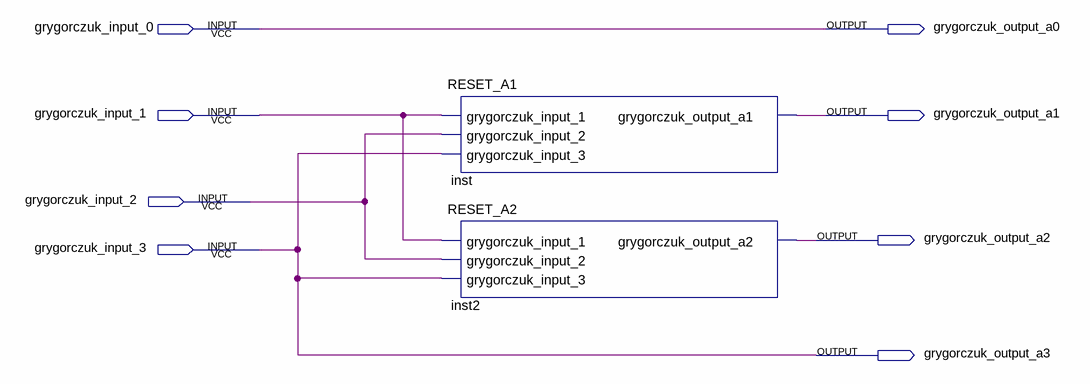
[diagram p0: schematic sheet]
// Quartus schematic RESET.bdf as structural Verilog: 2 symbols, 8 pins
module RESET (
  input  grygorczuk_input_0,
  input  grygorczuk_input_1,
  input  grygorczuk_input_2,
  input  grygorczuk_input_3,
  output grygorczuk_output_a0,
  output grygorczuk_output_a1,
  output grygorczuk_output_a2,
  output grygorczuk_output_a3
);

  RESET_A1 inst (
    .grygorczuk_input_1(grygorczuk_input_1), .grygorczuk_input_2(grygorczuk_input_2),
    .grygorczuk_input_3(grygorczuk_input_3), .grygorczuk_output_a1(grygorczuk_output_a1));
  RESET_A2 inst2 (
    .grygorczuk_input_1(grygorczuk_input_1), .grygorczuk_input_2(grygorczuk_input_2),
    .grygorczuk_input_3(grygorczuk_input_3), .grygorczuk_output_a2(grygorczuk_output_a2));

  assign grygorczuk_output_a0 = grygorczuk_input_0;
  assign grygorczuk_output_a3 = grygorczuk_input_3;
endmodule
